# EasyEDA Pro project ProPrj_承载我所有幻想的键盘_2025-02-09.epro, schematic 10-Schematic
Create Date: 2024-07-30; Page Name: P1; Project Name: 承载我所有幻想的键盘; Schematic Name: Schematic4; Update Date: 2024-07-30
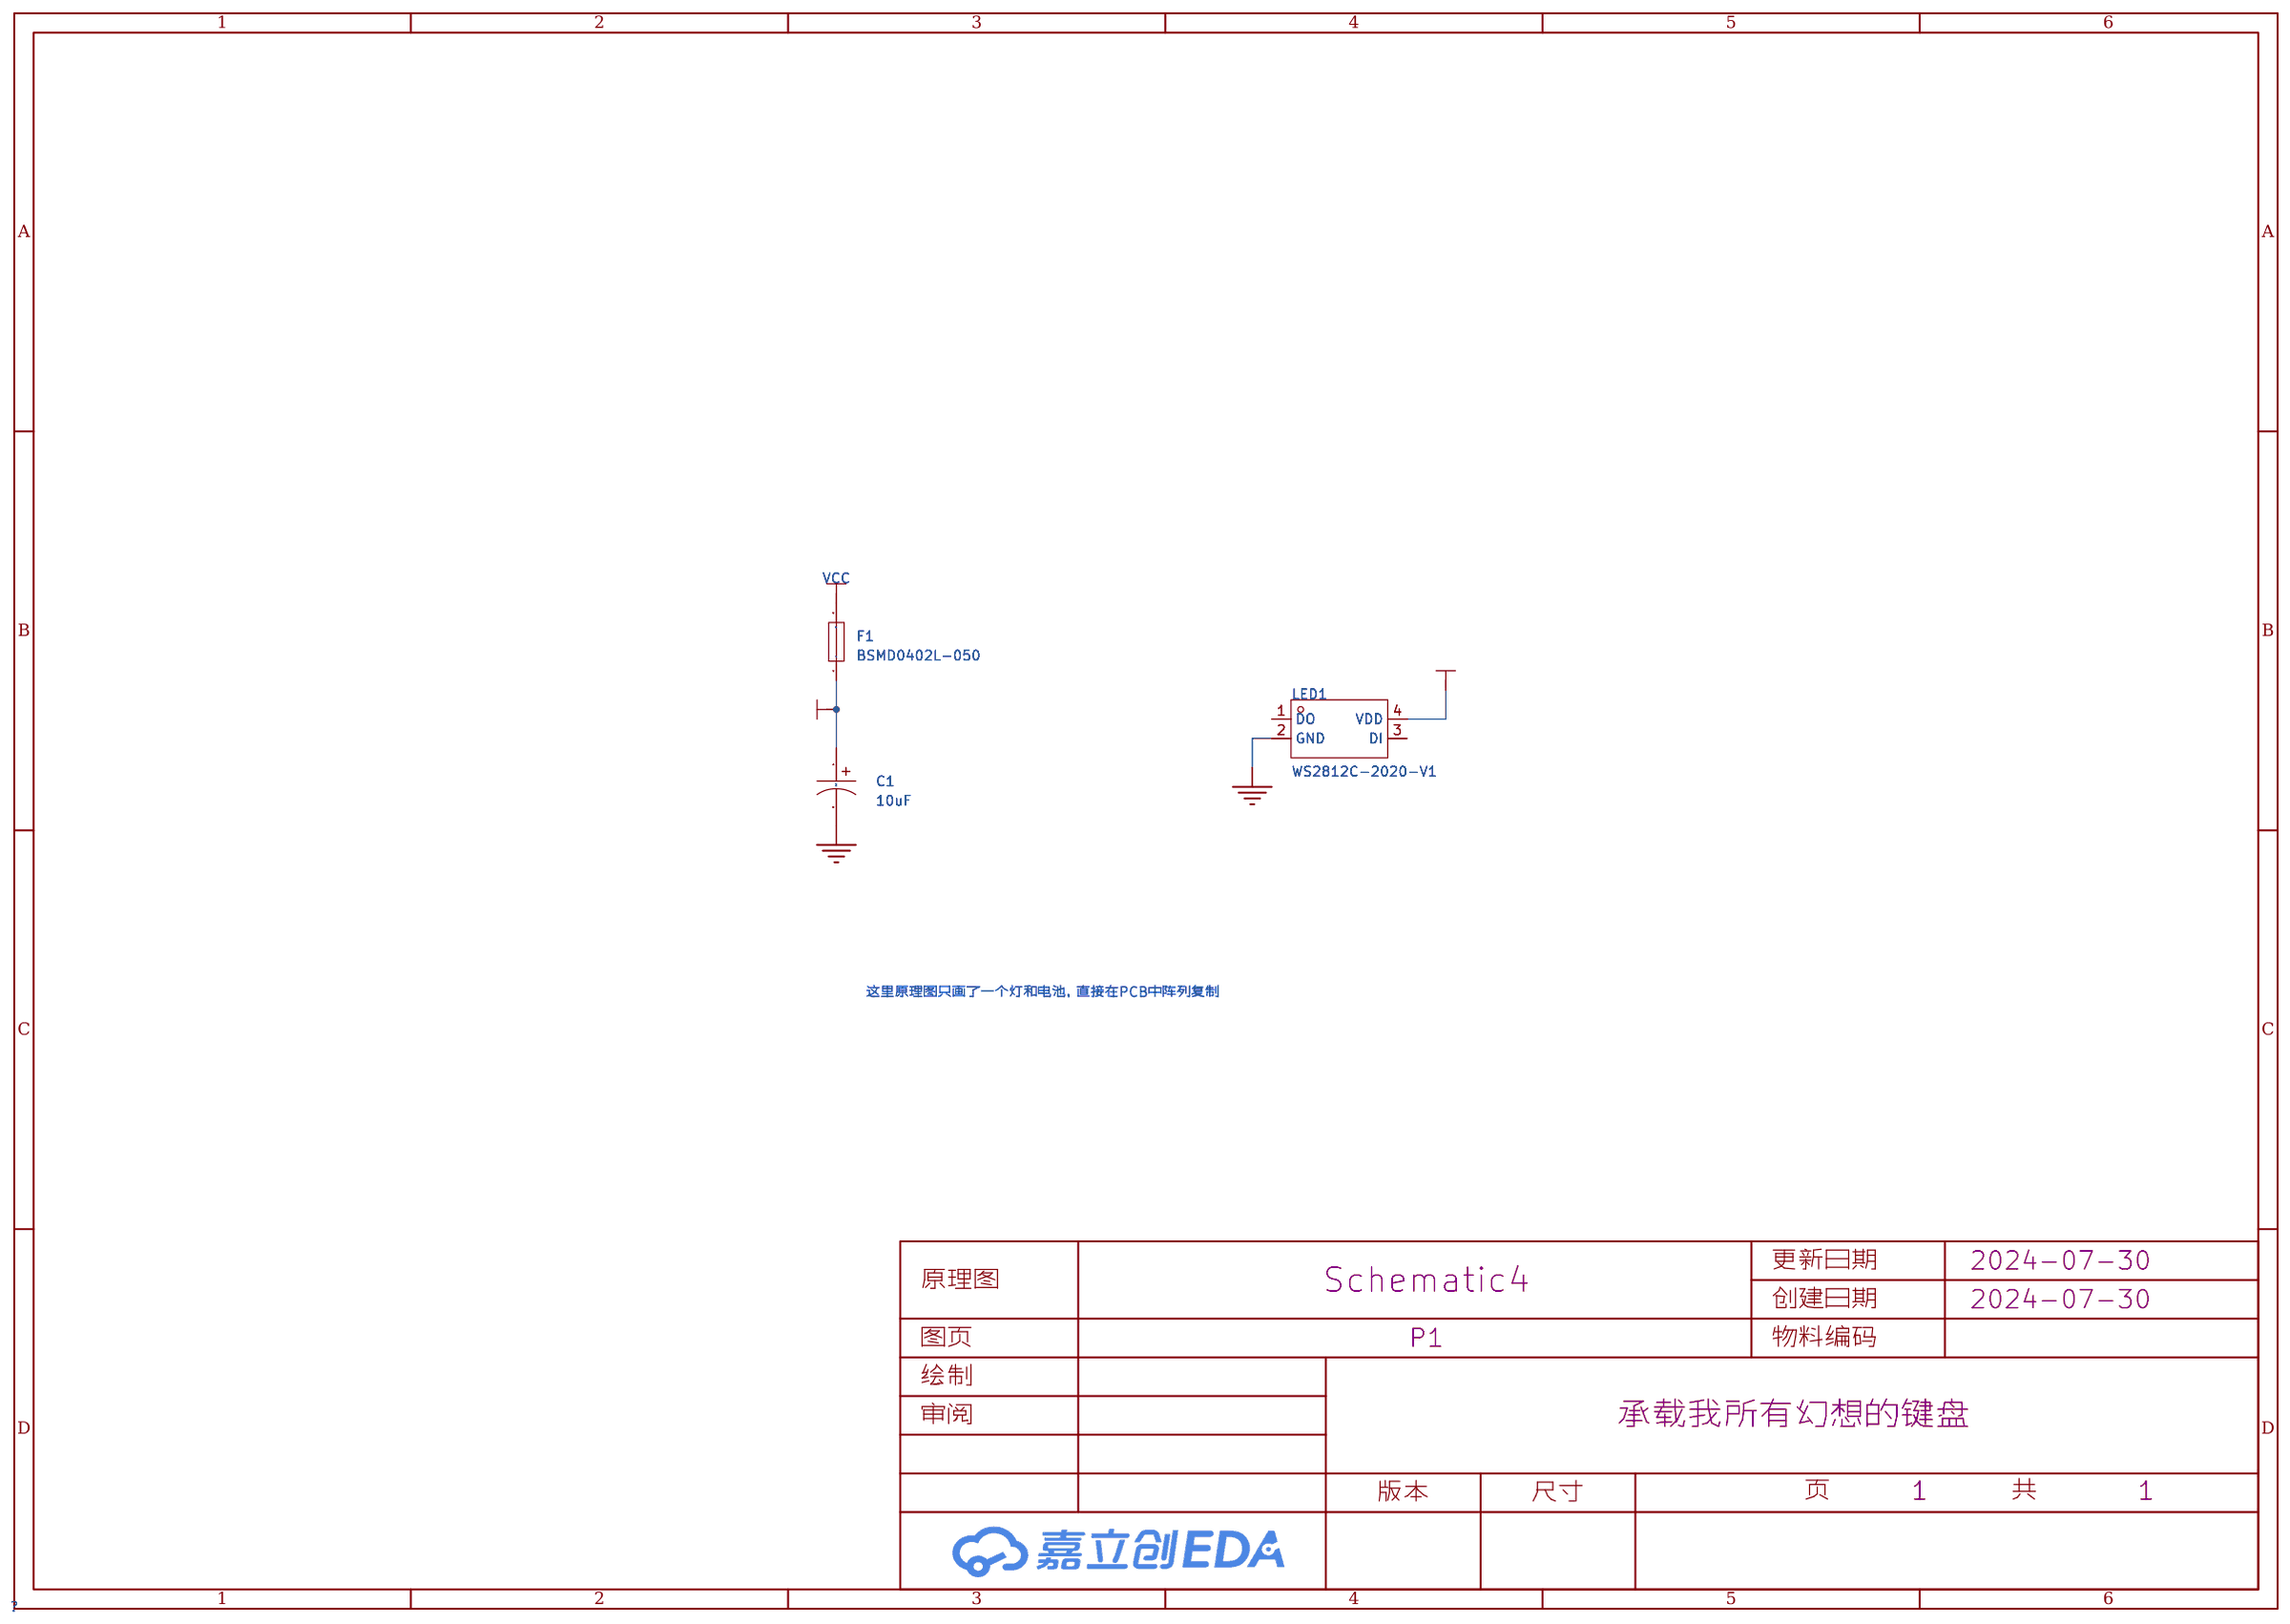
[diagram p23: schematic sheet]

## Parts
C1  10uF  [CAP-TH_BD8.0-P3.50-D0.6-FD_1]
F1  BSMD0402L-050  [F0402]
LED1  WS2812C-2020-V1  [LED-SMD_4P-L2.0-W2.0-TL_WS2812B-2020]

## Library data of the parts
C1 = 01EC4138MHT10uF400V: 容值:10uF;精度:±20%;额定电压:400V;纹波电流:145mA@100kHz;等效串联电阻:-;; LCSC Part Name: 10uF ±20% 400V; Supplier Part: C503216; Manufacturer: KNSCHA(科尼盛); Supplier Footprint: 插件,D8xL13mm; JLCPCB Part Class: 扩展库; Datasheet: https://atta.szlcsc.com/upload/public/pdf/source/20200324/C503216_5ABCAB2CBC400820562DE6D703B71585.pdf; Supplier: LCSC; Tolerance: ±20%; Rated Voltage: 400V; Ripple Current: 145mA@100kHz; Lead Spacing: 3.5mm; φD: 8mm; L: 13mm; Lifetime @ Temp: 4000hrs@105℃
F1 = BSMD0402L-050: 最大电压:6V;最大电流:40A;保持电流:500mA;跳闸电流:1A;; LCSC Part Name: 6V 500mA 0402自恢复; Supplier Part: C914087; Manufacturer: BHFUSE(佰宏); Supplier Footprint: 0402; JLCPCB Part Class: 扩展库; Datasheet: https://atta.szlcsc.com/upload/public/pdf/source/20230512/81993D19BE7C594631D65321B72A7525.pdf; Supplier: LCSC; Operating Voltage (Max): 6V; Current Rating (Max): 40A; Hold Current: 500mA; Trip Current: 1A; Power Dissipation: 500mW; Resistance - Initial (Ri) (Min): 40mΩ; Resistance - Post Trip (R1) (Max): 400mΩ; Maximum Time to Trip: 100ms; Operating Temperature: -40℃~+85℃
LED1 = WS2812C-2020-V1: 发光颜色:RGB三色;功率:-;正向电流:-;主波长:624nm；520nm；467nm;二极管配置:-;透镜颜色:-;色温:-;发光角度:-;载带方式:-;工作温度:-;; LCSC Part Name: RGB三色; Supplier Part: C2976072; Manufacturer: worldsemi; Supplier Footprint: SMD,2x2mm; JLCPCB Part Class: 扩展库; Datasheet: https://atta.szlcsc.com/upload/public/pdf/source/20220222/52A01000447F5320C9A8C3F34CEFDB81.pdf; Supplier: LCSC; Emitted Color: RGB三色; Dominant Wavelength: 624nm；520nm；467nm

## Nets
GND: C1.2 LED1.2(GND)
VBAT+: C1.1 F1.1
VCC: F1.2
VLED: LED1.4(VDD)

Not connected (* = marked no-connect by the designer): LED1 1(DO) 3(DI)

## Notes on the sheet
- 这里原理图只画了一个灯和电池，直接在PCB中阵列复制
